# EasyEDA Pro project ProPrj_MegaPocket_2025-07-17.epro, board PCB_MegaPocket_2025-05-22
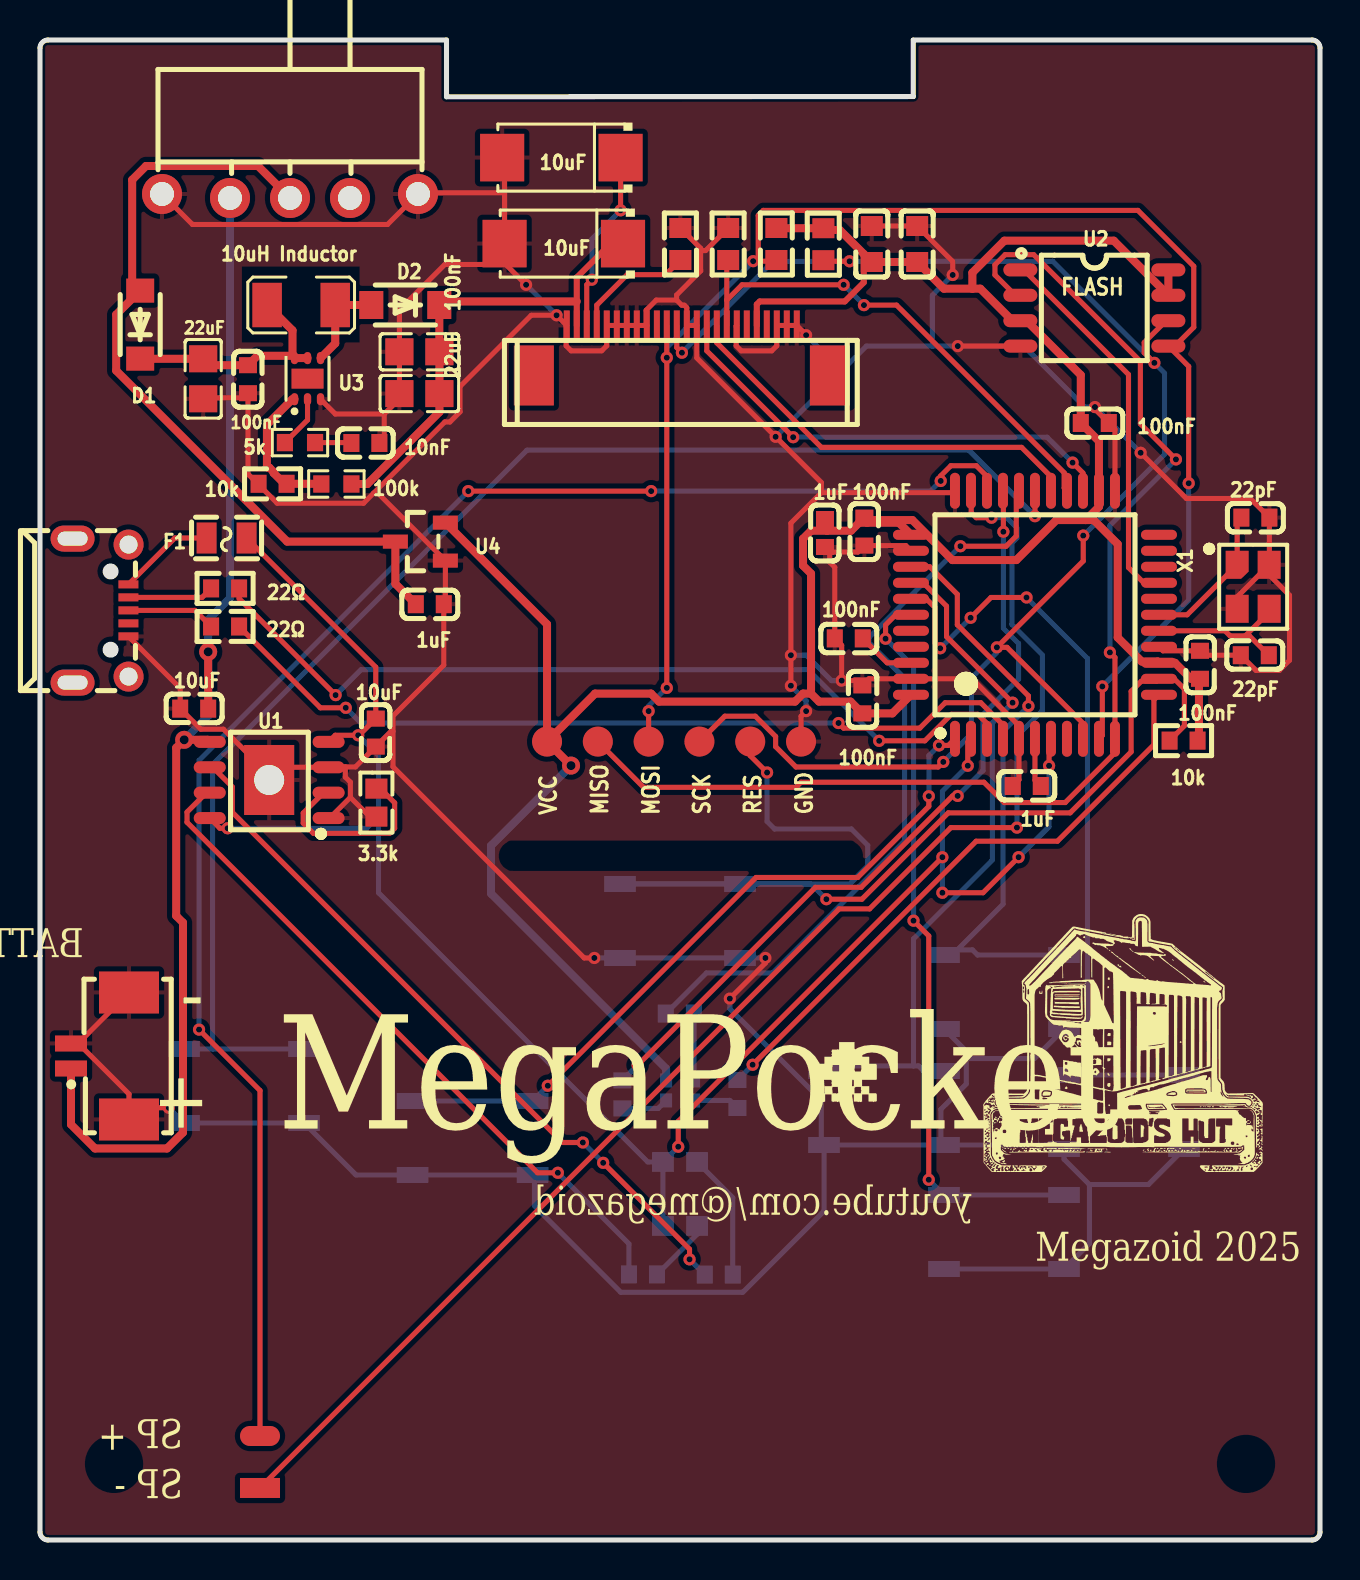
[diagram p1: board, top side]
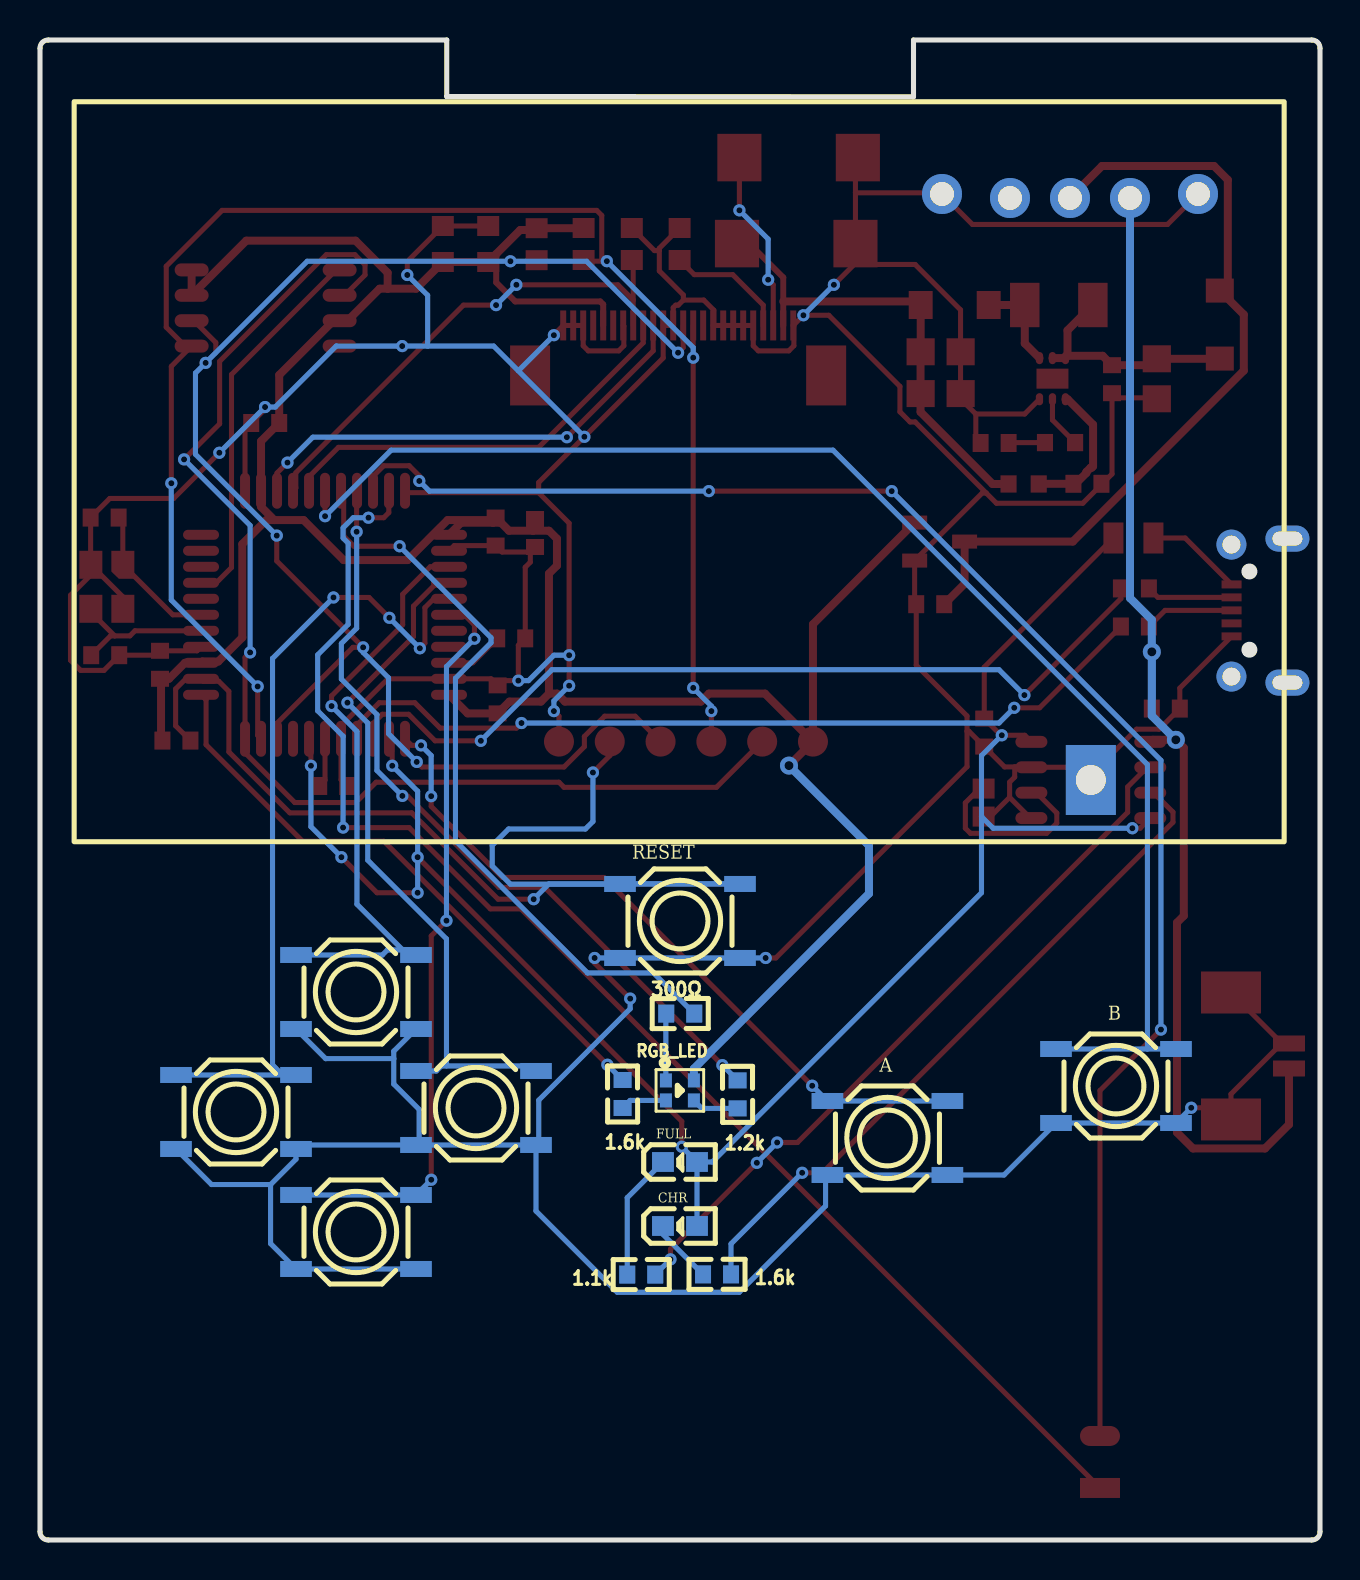
[diagram p2: board, bottom side, seen from below]

Outline 64 x 75 mm; copper layers: Top Layer, Bottom Layer. Coordinates in mm from the lower left corner of the outline.
Outline path: 0,74.59 0,0.41 arc(0.12,0.12) 0.41,0 63.59,0 arc(63.88,0.12) 64,0.41 64,74.59 arc(63.88,74.88) 63.59,75 43.66,75 43.66,72.17 20.33,72.16 20.33,75 0.41,75 arc(0.12,74.88) 0,74.59
Stack: Top Layer 0.035mm / Dielectric1 1.51mm FR4 er 4.5 / Bottom Layer 0.035mm

## Design rules (mm)
template: Custom Config
spacing copperThickness1oz (default): track to track 0.102, other pairs 0.152 to 0.3
spacing copperThickness2oz: track to track 0.203, other pairs 0.152 to 0.3
track width copperThickness1oz (default): min 0.127, default 0.254, max 2.54
track width copperThickness2oz: min 0.203, default 0.254, max 2.54
track width fat: min 0.127, default 0.4, max 2.54
differential pair differentialPair (default): width min 0.127, default 0.254, max 2.54; gap min 0.152, default 0.152
via viaSize (default): diameter min 0.5, default 0.61, max 10; hole min 0.3, default 0.305, max 6.3
via viaSize1: diameter min 0.5, default 0.9, max 10; hole min 0.3, default 0.45, max 6.3
net VCC uses fat, viaSize1
net B+ uses fat, viaSize1
net U1_3 uses fat, viaSize1
net +12V uses fat, viaSize1

## Placement (name value [footprint] x y rotation side)
1.1k  1.1K  [R0603#2]  33.94 13.27 180 bottom
1.2k  680  [R0603#2]  29.12 22.28 90 bottom
1.6k  -  [R0603#2]  30.15 13.28 180 bottom
1.6k#2  -  [R0603#2]  34.87 22.3 90 bottom
1uF  -  [C0603]  49.34 37.7 0 top
1uF#2  -  [C0603]  39.25 50.35 90 top
1uF#3  -  [C0603]  19.49 46.79 180 top
3.3k  1.2KΩ  [0603]  16.82 36.87 270 top
5k  5kΩ  [R0603]  13 54.87 0 top
10k  -  [R0603#2]  57.18 39.97 180 top
10k#2  -  [R0603#2]  11.63 52.81 180 top
10nF  10nF  [C0603]  16.27 54.85 0 top
10uF  -  [C0603]  7.71 41.57 0 top
10uF#2  -  [CAP-SMD_L6.0-W3.2-R-RD]  26.19 64.82 0 top
10uF#3  -  [C0603]  16.79 40.37 90 top
10uF#4  -  [CAP-SMD_L6.0-W3.2-R-RD]  26.07 69.12 0 top
10uH Inductor  10uh-1210  [L1210]  13.06 61.75 180 top
22pF  -  [C0603]  60.74 44.24 0 top
22pF#2  -  [C0603]  60.77 51.12 180 top
22uF  -  [C0805]  18.97 57.32 0 top
22uF#2  -  [C0805#2]  8.16 58.06 90 top
22Ω  -  [R0603#2]  9.25 45.67 0 top
22Ω#2  -  [R0603#2]  9.25 47.58 0 top
100k  100kΩ  [R0603]  14.82 52.8 0 top
100nF  -  [C0603]  40.44 45.08 180 top
100nF#2  -  [C0603]  52.74 55.85 180 top
100nF#3  -  [C0603]  41.22 50.42 90 top
100nF#4  -  [C0603]  58 43.76 270 top
100nF#5  -  [C0603]  41.12 42.03 270 top
100nF#6  -  [C0603]  10.4 58.04 90 top
100nF#7  -  [C0805]  18.97 59.41 180 top
300Ω  300  [R0603#2]  31.99 26.32 180 bottom
A  HX TS5220A 160GF  [SW-SMD_4P-L5.2-W5.2-P3.70-LS6.4]  21.63 20.1 180 bottom
B  HX TS5220A 160GF  [SW-SMD_4P-L5.2-W5.2-P3.70-LS6.4]  10.2 22.7 180 bottom
C16-7  4.7uF  [0603电容-LJJ]  41.59 64.8 90 top
C17-7  100nF  [0603电容-LJJ]  43.86 64.8 90 top
CHR  RED  [LED-0603]  32 15.7 180 bottom
D1  B5819W_C908224  [SOD-123_L2.8-W1.8-LS3.7-FD]  5.01 60.77 270 top
D2  B5819W_C908224  [SOD-123_L2.8-W1.8-LS3.7-FD]  18.27 61.75 0 top
DOWN  HX TS5220A 160GF  [SW-SMD_4P-L5.2-W5.2-P3.70-LS6.4]  48.2 15.4 180 bottom
F1  Ih1.1A_It1.8A  [F0805]  9.33 50.1 0 top
FULL  GREEN  [LED-0603]  32 18.9 180 bottom
LEFT  HX TS5220A 160GF  [SW-SMD_4P-L5.2-W5.2-P3.70-LS6.4]  54.2 21.4 180 bottom
NOREF  -  [Pad_e542]  25.35 39.92 0 top
NOREF#2  -  [Pad_e317]  11 5.2 0 top
NOREF#3  -  [Pad_e546]  35.51 39.92 0 top
NOREF#4  -  [Pad_e543]  27.89 39.92 0 top
NOREF#5  -  [Pad_e544]  30.43 39.92 0 top
NOREF#6  -  [Pad_e547]  38.05 39.92 0 top
NOREF#7  -  [Pad_e545]  32.97 39.92 0 top
NOREF#8  -  [Pad_e318]  11 2.6 180 top
P1-9  FPC 0.5MM 24P Pull type H2.0mm Pick up  [FPC-SMD_24P-L17.5-W5.4-P0.50]  32.09 59.48 0 top
R10-7  -  [0603电阻-LJJ]  36.82 64.8 90 top
R10-7#2  -  [0603电阻-LJJ]  39.17 64.79 90 top
R10-7#3  -  [0603电阻-LJJ]  34.41 64.8 90 top
R12-7  910K  [0603电阻-LJJ]  32.02 64.8 270 top
RESET  HX TS5220A 160GF  [SW-SMD_4P-L5.2-W5.2-P3.70-LS6.4]  32 30.95 180 bottom
RGB_LED  E6C0606RGBC3UDA  [LED-SMD_4P-L1.6-W1.6-TL-FD]  32.01 22.48 180 bottom
RIGHT  HX TS5220A 160GF  [SW-SMD_4P-L5.2-W5.2-P3.70-LS6.4]  42.2 21.6 180 bottom
SW1  KH-SS12F23-G6  [SW-TH_KH-SS12F23-G6]  12.5 67.2 180 top
U1  TP4056  [SOP-8_EP_150MIL]  11.46 38 180 top
U2  W25Q128JVSIQTR  [SOIC-8_L5.3-W5.3-P1.27-LS8.0-BL]  52.72 61.6 270 top
U3  TPS61170DRVR  [QFN-6_L2.0-W2.0-P0.65-TL-EP]  13.38 58.07 90 top
U4  -  [CONN-SMD_532610271]  3 24.2 270 top
U4#2  -  [SOT-23-3_L2.9-W1.3-P1.90-LS2.4-BR]  19.02 49.92 0 top
U5  ATMEGA32U4-AU  [QFP-44_L10.0-W10.0-P0.80-LS13.2-BL]  49.75 46.26 0 top
UP  HX TS5220A 160GF  [SW-SMD_4P-L5.2-W5.2-P3.70-LS6.4]  48.2 27.4 180 bottom
USB1  Micro USB  [MICRO-USB_MICRO-USB-30]  3.03 46.47 180 top
X1  16MHz  [OSC-SMD_4P-L3.2-W2.5-BL]  60.66 47.66 270 top

## Footprints (pads in the part's own frame, mm; a bottom-side part is the same pattern mirrored in y, then rotated)
0603
  rect 1x1.1 smd: 1(-0.7,0) 2(0.7,0)
0603电容-LJJ
  rect 1x1.1 smd: 1(-0.9,0) 2(0.9,0)
0603电阻-LJJ
  rect 1x1.1 smd: 1(-0.8,0) 2(0.8,0)
C0603
  rect 0.8x0.9 smd: 1(-0.7,0) 2(0.7,0)
C0805
  rect 1.41x1.35 smd: 1(-1,0) 2(1,0)
C0805#2
  rect 1.35x1.41 smd: 1(-1,0) 2(1,0)
CAP-SMD_L6.0-W3.2-R-RD
  rect 2.208x2.376 smd: 1(2.961,0) 2(-2.961,0)
CONN-SMD_532610271
  rect 0.8x1.6 smd: 1(0.625,-1.45) 2(-0.625,-1.45)
  rect 2.1x3 smd: 3(3.175,1.45) 4(-3.175,1.45)
F0805
  rect 1x1.55 smd: 1(-1,0) 2(1,0)
FPC-SMD_24P-L17.5-W5.4-P0.50
  rect 0.3x1.5 smd: 1(5.745,1.25) 2(5.245,1.25) 3(4.745,1.25) 4(4.245,1.25) 5(3.745,1.25) 6(3.245,1.25) 7(2.745,1.25) 8(2.245,1.25) 9(1.746,1.25) 10(1.246,1.25) 11(0.746,1.25) 12(0.245,1.25) 13(-0.255,1.25) 14(-0.754,1.25) 15(-1.25,1.25) 16(-1.754,1.25) 17(-2.255,1.25) 18(-2.754,1.25) 19(-3.254,1.25) 20(-3.756,1.25) 21(-4.256,1.25) 22(-4.756,1.25) 23(-5.256,1.25) 24(-5.756,1.25)
  rect 2x3 smd: 25(-7.401,-1.25) 26(7.401,-1.25)
L1210
  rect 1.474x2.22 smd: 1(1.703,0) 2(-1.703,0)
LED-0603
  rect 1.092x0.991 smd: 1(0.851,0) 2(-0.851,0)
LED-SMD_4P-L1.6-W1.6-TL-FD
  rect 0.6x0.7 smd: 1(-0.7,0.5) 2(0.7,0.5) 3(-0.7,-0.5) 4(0.7,-0.5)
MICRO-USB_MICRO-USB-30
  rect 1x0.4 smd: 1(-1.392,-1.31) 2(-1.392,-0.66) 3(-1.392,-0.01) 4(-1.392,0.639) 5(-1.392,1.29)
  round 1.5 hole 0.9: 6(-1.4,3.3) 9(-1.4,-3.3)
  oval 2.2x1.3 hole 1.5x0.7: 7(1.4,3.6) 8(1.4,-3.6)
OSC-SMD_4P-L3.2-W2.5-BL
  custom 1.4x1.15 smd: 1(-1.1,-0.8)
  rect 1.4x1.15 smd: 2(1.1,-0.8) 3(1.1,0.8) 4(-1.1,0.8)
Pad_e317
  oval 2x1 smd: 1(0,0)
Pad_e318
  rect 2x1 smd: 1(0,0)
Pad_e542
  round 1.5 smd: 1(0,0)
Pad_e543
  round 1.5 smd: 2(0,0)
Pad_e544
  round 1.5 smd: 3(0,0)
Pad_e545
  round 1.5 smd: 5(0,0)
Pad_e546
  round 1.5 smd: 4(0,0)
Pad_e547
  round 1.5 smd: 6(0,0)
QFN-6_L2.0-W2.0-P0.65-TL-EP
  oval 0.607x0.364 smd: 1(-1.028,0.65) 2(-1.028,0) 3(-1.028,-0.65) 4(1.028,-0.65) 5(1.028,0) 6(1.028,0.65)
  rect 1x1.6 smd: 7(0,0)
QFP-44_L10.0-W10.0-P0.80-LS13.2-BL
  oval 0.5x1.8 smd: 1(-4,-6.2) 2(-3.2,-6.2) 3(-2.4,-6.2) 4(-1.6,-6.2) 5(-0.8,-6.2) 6(0,-6.2) 7(0.8,-6.2) 8(1.6,-6.2) 9(2.4,-6.2) 10(3.2,-6.2) 11(4,-6.2) 23(4,6.2) 24(3.2,6.2) 25(2.4,6.2) 26(1.6,6.2) 27(0.8,6.2) 28(0,6.2) 29(-0.8,6.2) 30(-1.6,6.2) 31(-2.4,6.2) 32(-3.2,6.2) 33(-4,6.2)
  oval 1.8x0.5 smd: 12(6.2,-4) 13(6.2,-3.2) 14(6.2,-2.4) 15(6.2,-1.6) 16(6.2,-0.8) 17(6.2,0) 18(6.2,0.8) 19(6.2,1.6) 20(6.2,2.4) 21(6.2,3.2) 22(6.2,4) 34(-6.2,4) 35(-6.2,3.2) 36(-6.2,2.4) 37(-6.2,1.6) 38(-6.2,0.8) 39(-6.2,0) 40(-6.2,-0.8) 41(-6.2,-1.6) 42(-6.2,-2.4) 43(-6.2,-3.2) 44(-6.2,-4)
R0603
  rect 0.806x0.864 smd: 1(-0.753,0) 2(0.753,0)
R0603#2
  rect 0.8x0.9 smd: 1(-0.7,0) 2(0.7,0)
SOD-123_L2.8-W1.8-LS3.7-FD
  rect 1.2x1.4 smd: 1(-1.7,0) 2(1.7,0)
SOIC-8_L5.3-W5.3-P1.27-LS8.0-BL
  oval 0.65x1.7 smd: 1(-1.905,-3.7) 2(-0.635,-3.7) 3(0.635,-3.7) 4(1.905,-3.7) 5(1.905,3.7) 6(0.635,3.7) 7(-0.635,3.7) 8(-1.905,3.7)
SOP-8_EP_150MIL
  oval 1.6x0.6 smd: 1(-2.972,1.905) 2(-2.972,0.635) 3(-2.972,-0.635) 4(-2.972,-1.905) 5(2.972,-1.905) 6(2.972,-0.635) 7(2.972,0.635) 8(2.972,1.905)
  rect 2.5x3.5 hole 1x1.498: 9(0,0)
SOT-23-3_L2.9-W1.3-P1.90-LS2.4-BR
  rect 1.25x0.7 smd: 1(1.25,-0.95) 2(1.25,0.95) 3(-1.25,0)
SW-SMD_4P-L5.2-W5.2-P3.70-LS6.4
  rect 1.58x0.8 smd: 1(-3,1.85) 2(3,1.85) 3(-3,-1.85) 4(3,-1.85)
SW-TH_KH-SS12F23-G6
  round 2 hole 1.2: 1(-3,0.1) 2(0,0.1) 3(3,0.1) 4(6.4,-0.1) 5(-6.4,-0.1)

## Nets
+12V: 10uF#2.1 22uF.2 100k.2 100nF#7.1 D2.2 P1-9.23
GND: 1uF.1 1uF#2.1 1uF#3.1 3.3k.2 10k#2.2 10nF.2 10uF.1 10uF#2.2 10uF#3.1 10uF#4.2 22pF.1 22pF#2.1 22uF.1 22uF#2.1 100nF.2 100nF#2.1 100nF#3.1 100nF#4.1 100nF#5.1 100nF#6.1 100nF#7.2 A.3 A.4 B.3 B.4 C16-7.2 C17-7.2 DOWN.3 DOWN.4 LEFT.3 LEFT.4 NOREF#6.6 P1-9.1 P1-9.2 P1-9.3 P1-9.7 P1-9.11 P1-9.12 P1-9.16 P1-9.17 P1-9.18 P1-9.19 P1-9.20 P1-9.24 R10-7#3.2 R12-7.1 RESET.3 RESET.4 RIGHT.3 RIGHT.4 SW1.4 SW1.5 U1.1 U1.3 U1.9 U2.4 U3.3 U4.2 U4.3 U4.4 U4#2.1 U5.5 U5.15 U5.23 U5.33 U5.35 U5.43 UP.3 UP.4 USB1.5 X1.2 X1.4
VCC: 1uF#2.2 10k.1 100nF#2.2 100nF#3.2 100nF#4.2 100nF#5.2 C16-7.1 C17-7.1 NOREF.1 P1-9.5 R10-7.2 R10-7#2.2 RGB_LED.2 U2.3 U2.7 U2.8 U4#2.2 U5.14 U5.24 U5.34 U5.44
A4: U5.40
A5: U5.41
A_SW: A.1 A.2 U5.1
B+: 10uF.2 SW1.3 U1.5 U4.1
B_SW: B.1 B.2 U5.28
CLK: NOREF#7.5 P1-9.13 R10-7#2.1 U2.6 U5.9
D+: 22Ω.2 U5.4
D-: 22Ω#2.2 U5.3
DOWN_SW: DOWN.1 DOWN.2 U5.39
F1_1: F1.1 USB1.1
FULL_2: 1.1k.1 FULL.2
LEFT_SW: LEFT.1 LEFT.2 U5.38
MISO: NOREF#4.2 U2.2 U5.11
MOSI: NOREF#5.3 P1-9.14 R10-7.1 U2.5 U5.10
OLED_CS: P1-9.8 R10-7#3.1 U5.26
OLED_DC: P1-9.10 U5.25
OLED_RST: P1-9.9 U5.27
P1_15: P1-9.15
P1_22: 10uF#4.1 P1-9.22
PIEZO_P1: NOREF#2.1 U5.31
PIEZO_P2: NOREF#8.1 U5.32
R1_1: 22Ω#2.1 USB1.2
R2_1: 22Ω.1 USB1.3
R3_1: 5k.2 10nF.1
R4_2: P1-9.21 R12-7.2
R10_1: 1.6k.1 CHR.2
RGB_BLUE: 300Ω.2 U5.29
RGB_GREEN: 1.6k#2.2 U5.12
RGB_LED_1: 300Ω.1 RGB_LED.1
RGB_LED_3: 1.6k#2.1 RGB_LED.3
RGB_LED_4: 1.2k.1 RGB_LED.4
RGB_RED: 1.2k.2 U5.30
RIGHT_SW: RIGHT.1 RIGHT.2 U5.37
RST: 10k.2 NOREF#3.4 RESET.1 RESET.2 U5.13
RX: U5.20
RX_LED: U5.8
SCL: U5.18
SDA/FLASH_CS: U2.1 U5.19
TX: U5.21
TX_LED: U5.22
U1_1: 10k#2.1 100k.1 U3.1
U1_2: 5k.1 U3.2
U1_3: 1uF#3.2 D1.1 SW1.2 U4#2.3
U1_4: 10uH Inductor.2 D2.1 U3.4
U1_33: 10uH Inductor.1 22uF#2.2 100nF#6.2 D1.2 U3.5 U3.6
U2_6: 1uF.2 U5.6
U2_16: 22pF.2 U5.16 X1.3
U2_17: 22pF#2.2 U5.17 X1.1
U2_42: 100nF.1 U5.42
U4_2: 3.3k.1 U1.2
U4_6: 1.1k.2 U1.6
U4_7: 1.6k.2 U1.7
UP_SW: U5.36 UP.1 UP.2
UVCC: 10uF#3.2 CHR.1 F1.2 FULL.1 U1.4 U1.8 U5.2 U5.7
$1N2518: P1-9.6

Pads without a net: P1-9 4 25 26; SW1 1; U3 7; USB1 4 6 7 8 9

## Via types
v1: diameter 0.61, hole 0.305, Top Layer to Bottom Layer, 77 vias
v2: diameter 0.9, hole 0.45, Top Layer to Bottom Layer, 3 vias

## Routing (per net, layer and track width the routed paths; a pad name or vN(x,y) marks a point on that pad's centre or on a via; arc(x,y) is an arc through that point)
+12V: length 23.6
  Top Layer w0.3: 10uF#2.1 29.06,64.73 28.44,64.73 26.84,63.13 P1-9.23 ; 20.14,61.93 D2.2
  Top Layer w0.4: D2.2 19.97,59.37 ; 19.97,59.37 19.97,56.4 16.37,52.8 100k.2 ; 26.84,61.93 20.14,61.93
GND: length 391.4
  Top Layer w0.254: v1(45.89,59.7) U2.4 ; 16.69,52.35 20.24,55.9 20.5,55.9 21,56.41 21,57.68 24.56,61.24 v1(25.83,61.24) 26.34,60.73 26.31,60.7 26.31,59.71 26.56,59.46 28.08,59.46 28.34,59.71 P1-9.20 P1-9.19 P1-9.18 P1-9.17 P1-9.16 30.31,60.76 30.31,61.49 30.82,62 31.83,62 ; 16.69,52.35 16.89,52.35 U4#2.1 20.27,46.87 1uF#3.1 20.19,43.74 17.65,41.2 17.65,40.44 ; 16.69,52.35 16.18,51.84 11.86,51.84 10.84,52.85 ; v1(27.72,29.1) 27.21,29.1 17.65,38.66 17.65,40.44 ; R10-7#3.2 33.28,64.47 33.04,64.47 ; 15.27,38.66 14.45,38.66 U1.3 12.09,38.64 U1.9 11.46,38.26 9.17,40.54 8.04,40.54 10uF.1 7.01,42.59 USB1.5 ; 15.27,38.66 15.27,38.15 15.52,37.89 15.52,37.13 ; 15.27,38.66 15.77,38.66 10uF#3.1 17.56,40.44 17.65,40.44 ; v1(24.31,62.76) 23.29,63.78 ; 23.29,63.78 23.29,64.76 10uF#2.2 23.23,67.36 ; 23.29,63.78 20.24,63.78 17.97,61.51 17.97,57.06 17.21,56.3 ; X1.2 59.86,47.16 61.2,48.51 ; 10.4,57.11 10.4,53.3 10.84,52.85 ; 10.4,57.11 100nF#6.1 ; 10.4,57.11 8.21,57.11 22uF#2.1 ; 39.07,52.37 39.07,52.88 v1(36.78,55.16) 32.84,59.1 P1-9.11 P1-9.12 32.34,61.62 32.21,61.74 32.09,61.74 31.83,62 ; 39.07,52.37 37.54,50.84 v1(37.54,44.24) v1(37.54,42.71) ; 39.07,52.37 45.65,52.37 U5.33 ; v1(34.49,27.07) 36.27,28.85 v1(36.27,29.1) ; 3.3k.2 16.48,36.17 15.52,37.13 ; 10uF#4.2 23.23,69 23.23,67.36 ; R12-7.1 33.04,64.58 33.04,64.47 ; U5.23 53.75,55.54 100nF#2.1 52.75,56.54 v1(52.75,56.65) ; 39.48,49.4 39.48,48.89 39.74,48.64 100nF.2 40.08,44.74 v1(40.08,42.97) 40.88,42.97 100nF#5.1 41.45,43.06 U5.43 46.6,43.06 48.95,40.72 U5.5 48.95,38.01 1uF.1 ; 39.48,49.4 1uF#2.1 ; 39.48,49.4 40.9,49.4 100nF#3.1 43.29,49.72 U5.35 ; U5.15 56.15,44.46 100nF#4.1 58.22,44.24 22pF.1 60.8,43.48 61.97,43.48 62.48,43.99 62.48,47.24 61.2,48.51 ; 1.91,24.84 1.56,24.84 U4.2 ; 1.91,24.84 U4.4 ; 1.91,24.84 4.45,22.3 U4.3 5.04,21.61 v1(6.44,21.61) ; 10.84,52.85 10k#2.2 ; v1(45.64,63.25) 45.64,63.92 C17-7.2 C16-7.2 ; 15.52,37.13 14.48,36.1 U1.1 ; 23.23,67.36 18.96,67.36 SW1.5 17.38,65.78 7.62,65.78 SW1.4 ; v1(38.31,41.44) 38.05,41.19 NOREF#6.6 ; v1(38.31,60.24) 38.31,60.26 P1-9.1 P1-9.2 P1-9.3 36.84,59.71 36.59,59.46 35.06,59.46 34.81,59.71 34.81,60.7 P1-9.7 ; 31.83,62 31.83,62.25 33.04,63.46 33.04,64.47 ; 17.21,56.3 17.21,55.09 10nF.2 ; 17.21,56.3 14.77,56.3 U3.3 ; 61.2,48.51 X1.4 61.47,48.77 22pF#2.1 60.51,52.08 57.32,52.08 v1(55.03,54.36)
  Bottom Layer w0.254: 44.62,59.7 v1(45.89,59.7) 49.19,59.7 52.24,56.65 v1(52.75,56.65) v1(55.03,54.36) ; 44.62,59.7 41.32,59.7 40.08,58.46 ; 44.62,59.7 44.62,62.24 v1(45.64,63.25) ; v1(34.49,27.07) 34.49,26.56 39.06,21.99 39.06,19.89 RIGHT.4 ; 52.47,17.77 51.2,19.04 LEFT.4 51,19.75 RIGHT.3 45.04,19.75 ; 52.47,17.77 55.42,17.77 LEFT.3 ; 52.47,17.77 52.47,14.82 DOWN.3 DOWN.4 ; 46.31,24.07 46.31,22.8 45.04,21.53 45.04,19.75 ; 46.31,24.07 46.31,24.44 UP.4 ; 46.31,24.07 49.72,24.07 UP.3 ; v1(37.54,42.71) 38.31,41.95 v1(38.31,41.44) ; RIGHT.4 39.2,16.45 35.14,12.39 29.04,12.39 24.72,16.7 24.72,18.16 A.3 A.4 15.8,18.25 B.3 B.4 v1(6.44,21.61) ; RIGHT.4 45.04,19.75 ; v1(25.83,61.24) v1(24.31,62.76) ; v1(36.27,29.1) RESET.3 RESET.4 v1(27.72,29.1) ; v1(40.08,42.97) 39.58,42.97 38.31,44.24 v1(37.54,44.24) ; v1(36.78,55.16) 40.08,58.46 ; 40.08,58.46 v1(38.31,60.24)
VCC: length 146.6
  Top Layer w0.3: P1-9.5 35.84,61.78 35.99,61.93 40.24,61.93 41.19,62.88 41.19,64.3
  Top Layer w0.4: 38.55,42.32 38.95,41.92 40.53,41.92 100nF#5.2 42.62,41.33 U5.44 ; 38.55,42.32 38.15,42.32 37.75,41.92 30.95,41.92 30.55,42.32 27.75,42.32 NOREF.1 ; 38.55,42.32 38.55,48.32 38.15,48.72 38.15,50.06 38.55,50.46 39.35,50.46 ; 46.62,62.57 47.02,62.57 48.62,60.97 U2.3 49.32,60.97 52.04,58.25 100nF#2.2 52.95,54.94 U5.24 52.95,51.66 52.29,51 ; 46.62,62.57 45.19,62.57 C17-7.1 C16-7.1 39.99,65.5 39.26,65.5 R10-7#2.2 36.83,65.59 R10-7.2 ; 46.62,62.57 46.62,63.37 48.22,64.97 53.69,64.97 U2.7 U2.8 ; 39.35,50.46 40.55,50.46 40.95,50.86 41.35,50.86 ; 39.35,50.46 39.35,50.95 1uF#2.2 ; 57.95,43.06 57.95,40.04 10k.1 ; 57.95,43.06 100nF#4.2 ; 57.95,43.06 57.55,43.06 56.75,43.86 U5.14 55.89,43.92 55.08,43.92 53.89,45.12 53.89,49.8 52.68,51 52.29,51 ; 41.22,51 43.62,51 45.62,49 48.82,49 50.82,51 52.29,51 ; 41.22,51 100nF#3.2 ; 41.22,51 41.35,50.86 ; NOREF.1 25.35,45.79 U4#2.2 ; NOREF.1 v2(26.55,38.72) ; 41.35,50.86 42.95,50.86 U5.34
  Bottom Layer w0.4: v2(26.55,38.72) 22.55,34.72 22.55,32.32 31.31,23.57 RGB_LED.2
A_SW: length 36.1
  Top Layer w0.254: v1(25.39,22.71) 35.8,33.13 40.89,33.13 44.44,36.68 v1(44.44,37.19) ; U5.1 45.42,39.73 v1(44.95,39.73)
  Bottom Layer w0.254: v1(44.95,39.73) 44.44,39.22 v1(44.44,37.19) ; v1(25.39,22.71) A.1 A.2
B+: length 61.4
  Top Layer w0.4: U4.1 1.55,20.78 2.75,19.58 6.35,19.58 7.15,20.38 7.15,30.87 6.81,31.21 6.81,39.61 v2(7.21,40.01) 8.38,40.01 U1.5 ; v2(8.41,44.41) 10uF.2
  Bottom Layer w0.4: SW1.3 9.5,47.1 8.41,46.01 v2(8.41,44.41) 8.41,41.21 v2(7.21,40.01)
B_SW: length 70.5
  Top Layer w0.254: v1(49.75,51.19) U5.28
  Bottom Layer w0.254: 8.63,24.55 8.63,38.77 24.35,54.49 46.45,54.49 v1(49.75,51.19) ; 8.63,24.55 7.2,24.55 ; 8.63,24.55 13.2,24.55
CLK: length 78.9
  Top Layer w0.254: P1-9.13 31.84,59.62 v1(32.1,59.37) ; v1(40.48,63.94) 39.22,63.94 R10-7#2.1 ; v1(55.72,58.86) 55.21,59.37 55.21,59.87 56.3,60.97 U2.6 ; NOREF#7.5 34.24,41.19 35.77,41.19 36.78,40.17 36.78,39.67 37.8,38.65 44.91,38.65 v1(45.16,38.9) ; v1(52.16,50.22) 52.16,48.95 v1(47.84,44.63) 48.35,44.63 52.16,40.82 52.16,40.08 U5.9
  Bottom Layer w0.254: v1(47.84,44.63) 47.84,44.38 46.57,43.11 46.57,40.32 v1(45.16,38.9) ; v1(32.1,59.37) 36.67,63.94 v1(40.48,63.94) 50.64,63.94 v1(55.72,58.86) 56.23,58.35 56.23,54.29 v1(52.16,50.22)
D+: length 42
  Top Layer w0.254: v1(15.29,41.61) 14.02,41.61 22Ω.2 ; v1(39.93,40.85) 40.18,40.59 43.99,40.59 45.26,41.86 47.04,41.86 48.15,40.75 U5.4
  Bottom Layer w0.254: v1(39.93,40.85) 16.05,40.85 v1(15.29,41.61)
D-: length 43.4
  Top Layer w0.254: v1(14.78,42.25) 9.95,47.07 22Ω#2.2 ; v1(41.96,39.96) 44.24,39.96 45.57,41.29 46.89,41.29 47.35,40.82 U5.3
  Bottom Layer w0.254: v1(41.96,39.96) 38.4,43.52 16.05,43.52 v1(14.78,42.25)
DOWN_SW: length 37.2
  Top Layer w0.254: U5.39 42.79,46.26 42.28,45.75 v1(42.28,45.06) ; v1(44.44,18.01) 44.44,30.21 v1(43.68,30.97)
  Bottom Layer w0.254: v1(42.28,45.06) 43.68,43.67 v1(43.68,30.97) ; DOWN.1 DOWN.2 v1(44.44,18.01)
F1_1: length 4.9
  Top Layer w0.254: USB1.1 6.74,50.1 F1.1
FULL_2: length 6.4
  Bottom Layer w0.254: 1.1k.1 34.64,17.11 FULL.2
LEFT_SW: length 40.2
  Top Layer w0.254: U5.38 44.31,47.06 44.75,46.62 44.75,44.84 v1(45.01,44.59) ; v1(49.33,47.13) 47.55,47.13 v1(46.53,46.11)
  Bottom Layer w0.254: 51.87,23.25 LEFT.2 ; 51.87,23.25 52.37,23.76 52.37,44.08 v1(49.33,47.13) ; 51.87,23.25 LEFT.1 ; v1(46.53,46.11) v1(45.01,44.59)
MISO: length 62
  Top Layer w0.254: U2.2 48.77,62.24 47.75,63.25 47.75,63.76 48.26,64.27 49.68,64.27 55.02,58.93 55.02,55.81 v1(56.8,54.03) ; NOREF#4.2 30.18,37.63 37.8,37.63 38.05,37.89 47.2,37.89 48.21,36.87 51.26,36.87 53.75,39.36 U5.11 53.75,44.13 v1(53.49,44.38)
  Bottom Layer w0.254: v1(56.8,54.03) 53.49,50.73 v1(53.49,44.38)
MOSI: length 80.9
  Top Layer w0.254: 35.91,63.94 35.91,66.23 36.17,66.48 54.89,66.48 57.69,63.69 57.69,60.64 56.74,59.7 U2.5 57.43,58.68 v1(57.43,52.84) ; 35.91,63.94 v1(35.66,63.94) ; 35.91,63.94 36.76,63.94 R10-7.1 ; U5.10 53.12,40.23 v1(53.12,42.68) ; NOREF#5.3 v1(30.43,41.44) ; P1-9.14 v1(31.34,59.12) v1(31.34,42.61)
  Bottom Layer w0.254: v1(31.34,59.12) 31.34,59.62 v1(35.66,63.94) ; v1(31.34,42.61) 30.43,41.7 v1(30.43,41.44) ; v1(53.12,42.68) 57.43,47 v1(57.43,52.84)
OLED_CS: length 25.3
  Top Layer w0.254: 34.34,62 34.34,63.93 R10-7#3.1 ; 34.34,62 P1-9.8 ; 34.34,62 35.1,62.76 v1(40.18,62.76) ; U5.26 51.21,52.6 51.21,53.36 42.83,61.74 v1(41.2,61.74)
  Bottom Layer w0.254: v1(40.18,62.76) v1(41.2,61.74)
OLED_DC: length 23.5
  Top Layer w0.254: P1-9.10 33.34,59.46 v1(37.66,55.14) ; v1(51.63,53.87) 52.15,53.35 U5.25
  Bottom Layer w0.254: v1(37.66,55.14) 50.36,55.14 v1(51.63,53.87)
OLED_RST: length 21.1
  Top Layer w0.254: U5.27 50.55,53.16 49.08,54.63 39.07,54.63 33.84,59.86 P1-9.9
P1_22: length 9.1
  Top Layer w0.254: v1(27.59,63.01) 27.34,62.76 P1-9.22 ; v1(29.03,66.48) 10uF#4.1
  Bottom Layer w0.254: v1(29.03,66.48) 27.59,65.05 v1(27.59,63.01)
PIEZO_P1: length 81.6
  Top Layer w0.254: NOREF#2.1 11,22.47 v1(7.95,25.52) ; v1(45.04,52.95) 45.04,53.21 45.54,53.72 46.81,53.72 47.32,53.21 47.32,52.49 U5.31 ; v1(21.41,52.45) v1(30.56,52.45)
  Bottom Layer w0.254: v1(30.56,52.45) 44.53,52.45 v1(45.04,52.95) ; v1(21.41,52.45) 7.95,38.98 v1(7.95,25.52)
PIEZO_P2: length 71.5
  Top Layer w0.254: v1(47.58,51.12) 46.81,51.12 46.56,51.37 46.56,52.45 U5.32 ; v1(48.85,35.62) 45.54,35.62 41.48,31.56 39.96,31.56 NOREF#8.1
  Bottom Layer w0.254: v1(48.85,35.62) 48.85,40.19 50.12,41.46 50.12,44.26 48.59,45.78 48.59,49.85 48.85,50.1 48.85,50.61 48.34,51.12 v1(47.58,51.12)
R1_1: length 4.3
  Top Layer w0.254: 8.55,47.58 8.11,47.13 USB1.2
R2_1: length 4.5
  Top Layer w0.254: 8.55,45.67 7.75,46.48 USB1.3
R3_1: length 1.8
  Top Layer w0.254: 5k.2 15.55,54.87 10nF.1
R4_2: length 6.1
  Top Layer w0.254: R12-7.2 31.29,63.27 29.36,63.27 27.84,61.74 P1-9.21
R10_1: length 3.2
  Bottom Layer w0.254: CHR.2 32.85,15.28 1.6k.1
RGB_BLUE: length 38.2
  Top Layer w0.254: U5.29 48.82,52.33 48.82,50.2 48.31,49.69 v1(46.02,49.69)
  Bottom Layer w0.254: 300Ω.2 33.32,28.35 36.62,28.35 43.23,34.96 43.23,43.09 41.45,44.86 41.45,45.12 v1(46.02,49.69)
RGB_GREEN: length 30.4
  Top Layer w0.254: U5.12 55.7,42.01 55.7,39.77 50.87,34.94 46.81,34.94 v1(35.63,23.76)
  Bottom Layer w0.254: 1.6k#2.2 v1(35.63,23.76)
RGB_LED_1: length 3.4
  Bottom Layer w0.254: RGB_LED.1 32.71,26.3 300Ω.1
RGB_LED_3: length 2.3
  Bottom Layer w0.254: RGB_LED.3 34.49,21.98 1.6k#2.1
RGB_LED_4: length 2.4
  Bottom Layer w0.254: RGB_LED.4 30.91,21.58 1.2k.1
RGB_RED: length 39.5
  Top Layer w0.254: v1(29.88,23.74) 38.77,32.63 41.06,32.63 45.63,37.21 v1(45.88,37.21) ; v1(48.17,50.41) 48.17,52.44 U5.30
  Bottom Layer w0.254: v1(45.88,37.21) 47.15,38.48 47.15,41.27 48.93,43.05 48.93,44.83 48.17,45.59 v1(48.17,50.41) ; 1.2k.2 v1(29.88,23.74)
RIGHT_SW: length 34.9
  Top Layer w0.254: v1(48.63,41.87) 45.33,45.17 45.33,46.69 44.16,47.86 U5.37
  Bottom Layer w0.254: 43.68,23.71 39.45,23.71 RIGHT.2 ; 43.68,23.71 43.93,23.71 44.18,23.45 RIGHT.1 ; 43.68,23.71 43.68,30.06 47.61,33.99 47.61,40.85 v1(48.63,41.87)
RST: length 61.7
  Top Layer w0.254: v1(39.32,32.04) 41.1,32.04 45.41,36.36 51.51,36.36 54.56,39.41 54.56,42.43 55.07,42.94 55.83,42.94 U5.13 56.71,43.06 57.22,42.55 57.22,40.71 10k.2 ; v1(36.35,38.38) 35.51,39.22 NOREF#3.4
  Bottom Layer w0.254: 38.57,32.79 v1(39.32,32.04) ; 38.57,32.79 40.48,32.79 41.39,33.7 41.39,34.73 40.57,35.55 36.73,35.55 36.35,35.93 v1(36.35,38.38) ; 38.57,32.79 35.01,32.79 RESET.1 ; 38.57,32.79 38.56,32.8 RESET.1 ; 29.01,32.81 35,32.81 RESET.1 ; RESET.1 RESET.2
SDA/FLASH_CS: length 19.1
  Top Layer w0.254: U2.1 49.19,63.51 54.42,58.28 54.42,48.62 55.19,47.86 U5.19
U1_1: length 7.1
  Top Layer w0.4: 100k.1 14.06,52.81 10k#2.1 12.22,52.81 11.68,53.35 11.68,53.41 11.47,53.61 11.42,53.61 11.35,53.68 11.35,55.77 12.62,57.04 U3.1
U1_2: length 2.6
  Top Layer w0.254: U3.2 13.38,56 5k.1
U1_3: length 40.1
  Top Layer w0.4: SW1.2 10.9,68.7 5.3,68.7 4.61,68.01 4.61,62.87 D1.1 3.81,61.27 3.81,58.47 12.36,49.92 U4#2.3 17.77,47.81 1uF#3.2
U1_4: length 4.8
  Top Layer w0.4: U3.4 14.76,59.83 10uH Inductor.2 D2.1
U1_33: length 11.8
  Top Layer w0.254: 12.63,59.21 U3.6
  Top Layer w0.4: D1.2 5.02,59.06 22uF#2.2 8.48,58.74 100nF#6.2 10.87,59.21 12.63,59.21 12.63,60.48 10uH Inductor.1 ; U3.6 U3.5
U2_6: length 2.5
  Top Layer w0.254: U5.6 49.75,37.99 1uF.2
U2_16: length 7.8
  Top Layer w0.254: U5.16 59.25,45.46 59.5,45.21 60.27,45.21 ; 60.27,45.21 61.46,46.4 X1.3 ; 60.27,45.21 60.47,45.21 22pF.2
U2_17: length 7.4
  Top Layer w0.254: 22pF#2.2 59.86,50.91 X1.1 57.36,46.26 U5.17
U2_42: length 2.9
  Top Layer w0.254: U5.42 42.36,43.86 100nF.1
U4_2: length 9.6
  Top Layer w0.254: 3.3k.1 17.02,37.57 17.73,36.86 17.73,35.59 17.48,35.33 13.67,35.33 13.16,35.84 13.16,36.35 14.18,37.37 U1.2
U4_6: length 36.3
  Top Layer w0.254: U1.6 8.64,38.64 9.62,37.66 9.62,36.39 26.13,19.88 v1(27.14,19.88) ; v1(32.48,14.03) 32.48,14.54 v1(28.16,18.86)
  Bottom Layer w0.254: 1.1k.2 v1(32.48,14.03) ; v1(28.16,18.86) v1(27.14,19.88)
U4_7: length 34.4
  Top Layer w0.254: v1(25.89,18.36) 24.88,18.36 7.35,35.89 7.35,36.4 8.32,37.37 U1.7
  Bottom Layer w0.254: v1(25.89,18.36) 29.45,14.81 1.6k.2
UP_SW: length 29.8
  Top Layer w0.254: v1(49.42,41.7) 49.42,42.21 45.87,45.76 45.87,47.29 44.49,48.66 U5.36
  Bottom Layer w0.254: 45.87,29.51 48.15,31.79 48.15,40.43 v1(49.42,41.7) ; 45.87,29.51 46.63,29.51 46.88,29.25 UP.1 ; 45.87,29.51 45.45,29.51 UP.2
UVCC: length 95.2
  Top Layer w0.254: v1(48.93,34.14) 47.15,32.36 v1(45.12,32.36) ; v1(9.38,35.59) 8.99,35.59 U1.8 ; F1.2 16.79,43.64 10uF#3.2 15.95,40.24 v1(15.91,40.24) 14.76,40.24 U1.4 ; U5.7 50.45,39.97 v1(50.45,38.71) ; v1(45.12,34.14) 31.91,20.93 v1(31.91,19.66) ; v1(46.39,38.71) 46.39,39.9 U5.2
  Bottom Layer w0.254: v1(15.91,40.24) 16.93,39.22 16.93,36.17 ; v1(9.38,35.59) 16.34,35.59 16.93,36.17 ; CHR.1 FULL.1 ; FULL.1 v1(31.91,19.66) ; FULL.1 30.39,18.9 16.93,32.36 16.93,36.17 ; v1(50.45,38.71) 50.45,35.67 v1(48.93,34.14) ; v1(46.39,38.71) 45.12,37.44 v1(45.12,34.14) v1(45.12,32.36)

## Copper pours and planes (outline as drawn; the poured copper is in the pictures)
GND on Top Layer: -2.68,76.42 66.64,76.42 66.64,-3.12 -2.68,-3.12

## Text on the board
Document Layer: v0.2 -22/05/25
Top Silkscreen Layer: FLASH | VCC | MISO | MOSI | SCK | RES | GND | Megazoid 2025 | BATTERY | SP + | SP - | youtube.com/@megazoid | - | + | MegaPocket
